# Altium project VentilatorRev1InterimDaughtercard.PrjPcb
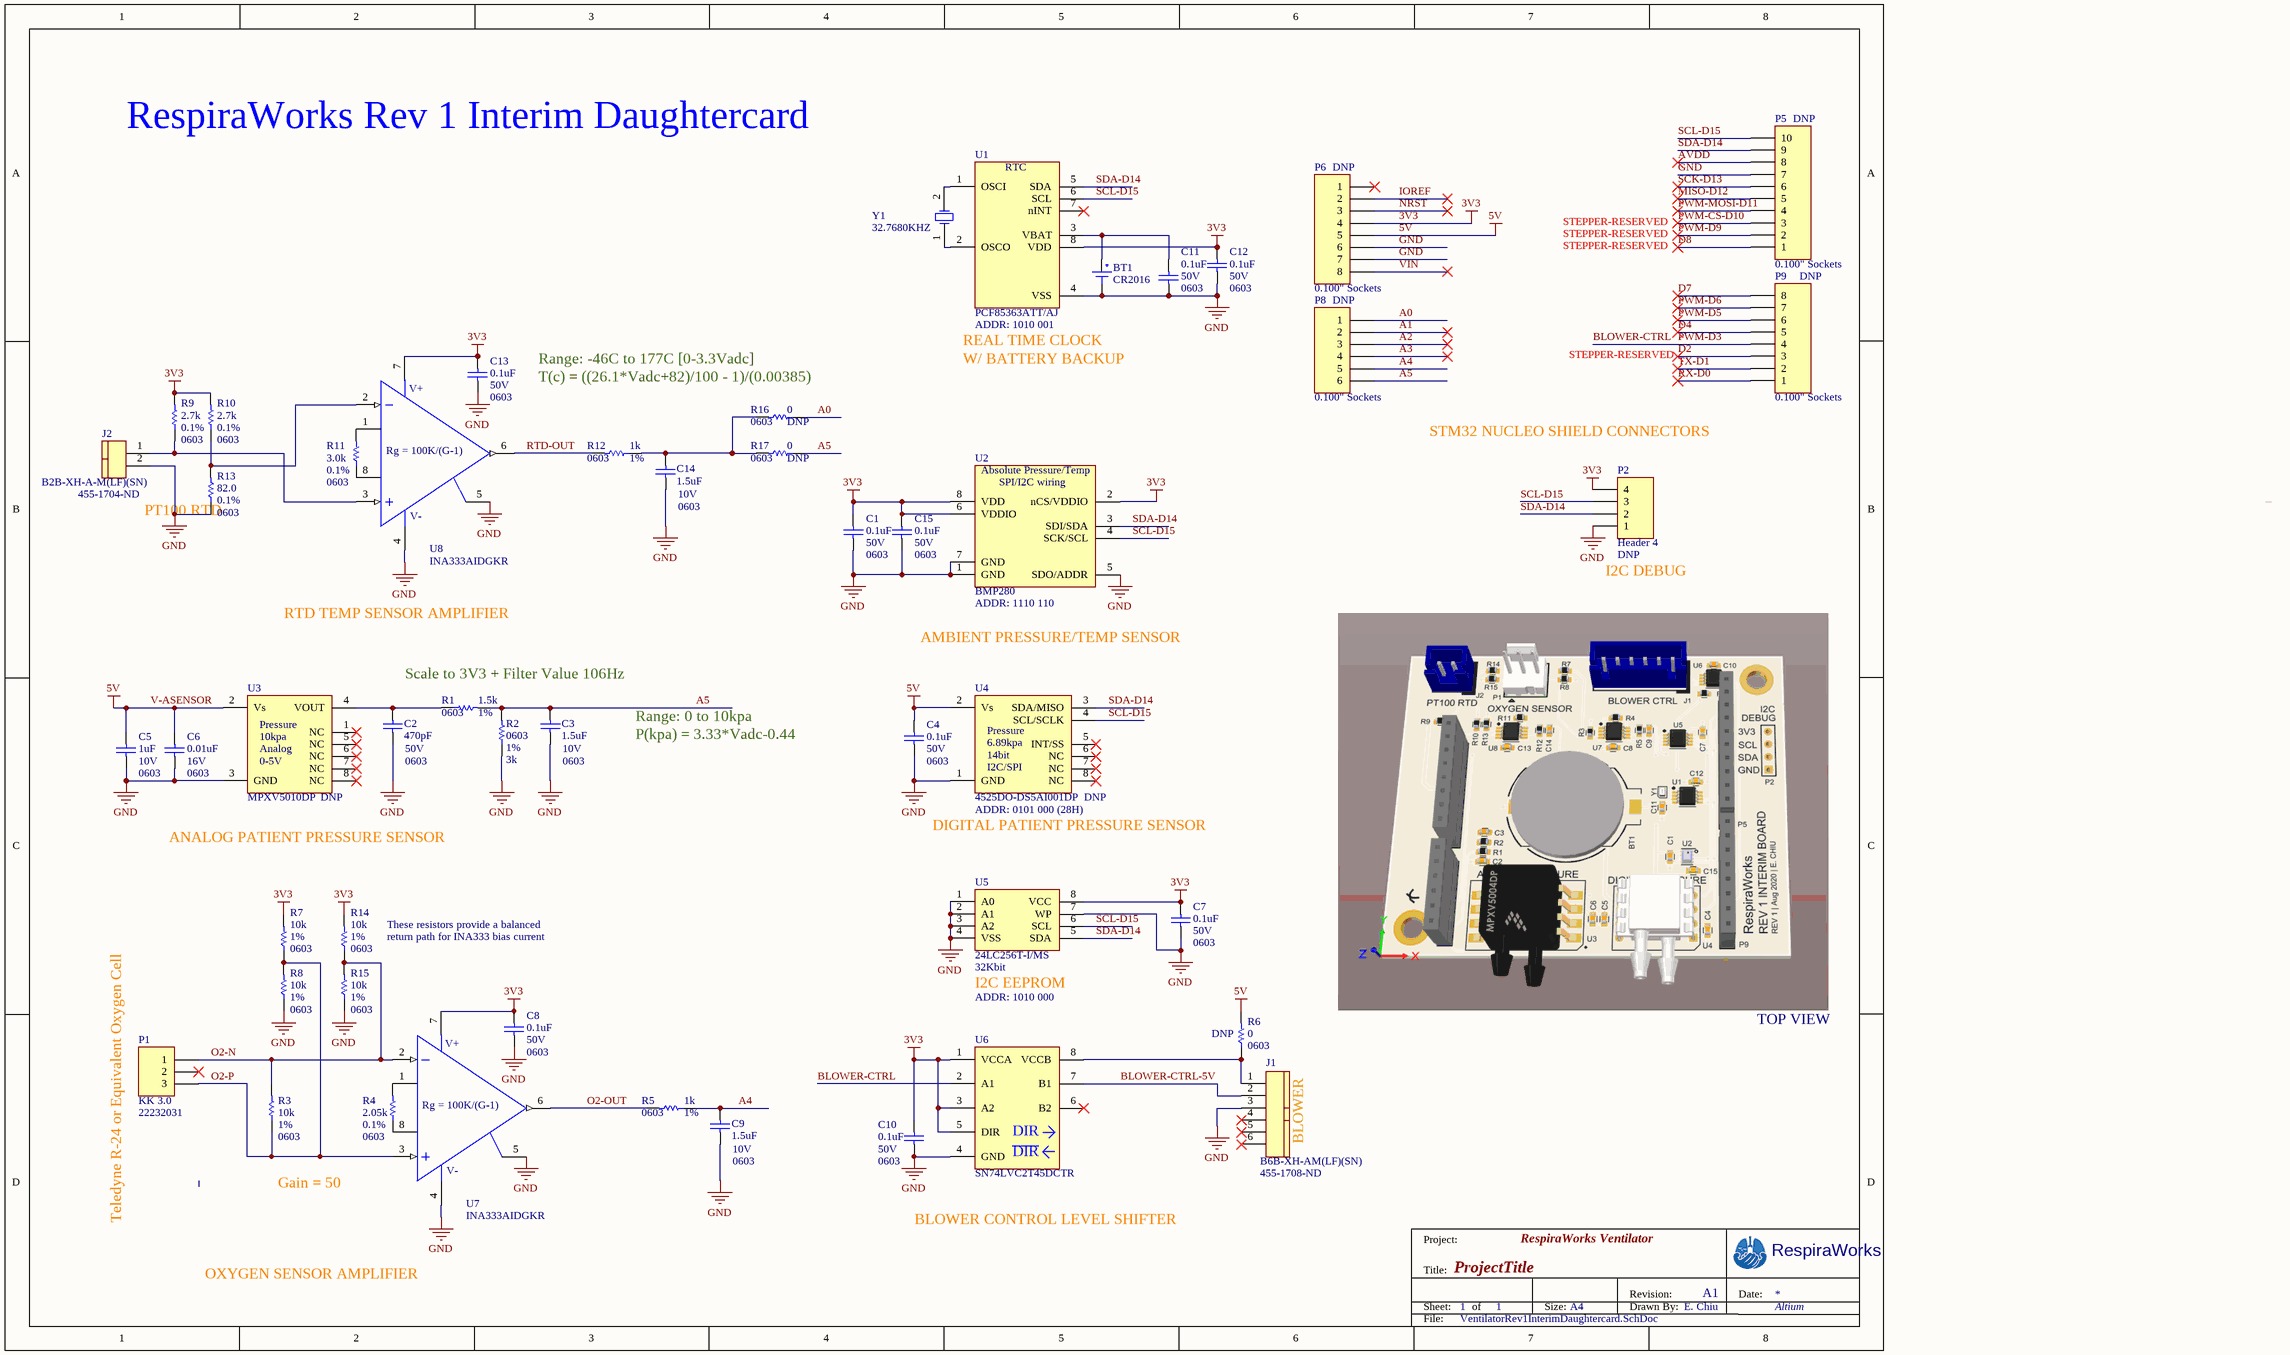
[diagram p0: VentilatorRev1InterimDaughtercard.SchDoc]
1 sheet, 50 parts. Net scope: global (net labels, ports and power ports of the same name join across sheets).
Board file: VentilatorRev1InterimDaughtercard.PcbDoc

## Sheet VentilatorRev1InterimDaughtercard.SchDoc: ProjectTitle
size A3; CompanyName: RespiraWorks; DrawnBy: E. Chiu; Organization: Altium; DocumentNumber: 1; Revision: A1; SheetNumber: 1; SheetTotal: 1; PageSetup: Record=PageOptions|CenterHorizontal=True|CenterVertical=True|PrintScale=0.67|XCorrection=1.00|YCorrection=1.00|PrintKind=0|BorderSize=5000000|LeftOffset=0|BottomOffset=0|Orientation=2|PaperLength=1000|PaperWidth=1000|Scale=100|PaperSource=276|PrintQuality=-3|MediaType=1|DitherType=10|PrintScaleMode=1|PaperKind=11"x17" 279.4x431.8mm|PaperIndex=3; ProjectName: FALCON 3S

### Parts
BT1  CR2016  [BLP20]
C1  value 0.1uF  Voltage: 50V  PCB Package: 0603  [CAP0603]  (hidden comment: CAP 0603)
C2  value 470pF  Voltage: 50V  PCB Package: 0603  [CAP0603]  (hidden comment: CAP 0603)
C3  value 1.5uF  Voltage: 10V  PCB Package: 0603  [CAP0603]  (hidden comment: CAP 0603)
C4  value 0.1uF  Voltage: 50V  PCB Package: 0603  [CAP0603]  (hidden comment: CAP 0603)
C5  value 1uF  Voltage: 10V  PCB Package: 0603  [CAP0603]  (hidden comment: CAP 0603)
C6  value 0.01uF  Voltage: 16V  PCB Package: 0603  [CAP0603]  (hidden comment: CAP 0603)
C7  value 0.1uF  Voltage: 50V  PCB Package: 0603  [CAP0603]  (hidden comment: CAP 0603)
C8  value 0.1uF  Voltage: 50V  PCB Package: 0603  [CAP0603]  (hidden comment: CAP 0603)
C9  value 1.5uF  Voltage: 10V  PCB Package: 0603  [CAP0603]  (hidden comment: CAP 0603)
C10  value 0.1uF  Voltage: 50V  PCB Package: 0603  [CAP0603]  (hidden comment: CAP 0603)
C11  value 0.1uF  Voltage: 50V  PCB Package: 0603  [CAP0603]  (hidden comment: CAP 0603)
C12  value 0.1uF  Voltage: 50V  PCB Package: 0603  [CAP0603]  (hidden comment: CAP 0603)
C13  value 0.1uF  Voltage: 50V  PCB Package: 0603  [CAP0603]  (hidden comment: CAP 0603)
C14  value 1.5uF  Voltage: 10V  PCB Package: 0603  [CAP0603]  (hidden comment: CAP 0603)
C15  value 0.1uF  Voltage: 50V  PCB Package: 0603  [CAP0603]  (hidden comment: CAP 0603)
J1  Supplier Part Number 1: 455-1708-ND  [JST_B6B-XH-AM]  (hidden comment: B6B-XH-AM(LF)(SN))
J2  Manufacturer P/N: B2B-XH-A-M(LF)(SN)  Supplier Part Number 1: 455-1704-ND  [JST_B2B-XH-AM]  (hidden comment: B2B-XH-AM(LF)(SN))
P1  KK 3.0  [22232031]
P2  Header 4  Do Not Populate: DNP  [HDR1X4]
P5  0.100" Sockets  Do Not Populate: DNP  [ESQ-110-14-T-S]
P6  0.100" Sockets  Do Not Populate: DNP  [ESQ-108-14-T-S]
P8  0.100" Sockets  Do Not Populate: DNP  [ESQ-106-14-T-S]
P9  0.100" Sockets  Do Not Populate: DNP  [ESQ-108-14-T-S]
R1  value 1.5k  PCB Package: 0603  Tolerance: 1%  [RES0603]  (hidden comment: RES 0603)
R2  value 3k  PCB Package: 0603  Tolerance: 1%  [RES0603]  (hidden comment: RES 0603)
R3  value 10k  PCB Package: 0603  Tolerance: 1%  [RES0603]  (hidden comment: RES 0603)
R4  value 2.05k  PCB Package: 0603  Tolerance: 0.1%  [RES0603]  (hidden comment: RES 0603)
R5  value 1k  PCB Package: 0603  Tolerance: 1%  [RES0603]  (hidden comment: RES 0603)
R6  value 0  PCB Package: 0603  Do Not Populate: DNP  [RES0603]  (hidden comment: RES 0603)
R7  value 10k  PCB Package: 0603  Tolerance: 1%  [RES0603]  (hidden comment: RES 0603)
R8  value 10k  PCB Package: 0603  Tolerance: 1%  [RES0603]  (hidden comment: RES 0603)
R9  value 2.7k  PCB Package: 0603  Tolerance: 0.1%  [RES0603]  (hidden comment: RES 0603)
R10  value 2.7k  PCB Package: 0603  Tolerance: 0.1%  [RES0603]  (hidden comment: RES 0603)
R11  value 3.0k  PCB Package: 0603  Tolerance: 0.1%  [RES0603]  (hidden comment: RES 0603)
R12  value 1k  PCB Package: 0603  Tolerance: 1%  [RES0603]  (hidden comment: RES 0603)
R13  value 82.0  PCB Package: 0603  Tolerance: 0.1%  [RES0603]  (hidden comment: RES 0603)
R14  value 10k  PCB Package: 0603  Tolerance: 1%  [RES0603]  (hidden comment: RES 0603)
R15  value 10k  PCB Package: 0603  Tolerance: 1%  [RES0603]  (hidden comment: RES 0603)
R16  value 0  PCB Package: 0603  Do Not Populate: DNP  [RES0603]  (hidden comment: RES 0603)
R17  value 0  PCB Package: 0603  Do Not Populate: DNP  [RES0603]  (hidden comment: RES 0603)
U1  PCF85363ATT/AJ  [8-MSOP-3.0MM]
U2  BMP280  [BMP280]
U3  Do Not Populate: DNP  [8-SOP-MPXV]  (hidden comment: MPXV5010DP)
U4  Do Not Populate: DNP  [4525do]  (hidden comment: 4525DO-DS5AI001DP)
U5  value 32Kbit  [8-MSOP]  (hidden comment: 256Kbit)
U6  SN74LVC2T45DCTR  [8-MSOP]
U7  Manufacturer P/N: INA333AIDGKR  [8-VSSOP]  (hidden comment: INA333)
U8  Manufacturer P/N: INA333AIDGKR  [8-VSSOP]  (hidden comment: INA333)
Y1  32.7680KHZ  [2-ABS05]

### Nets
3V3: C1.2 C7.2 C8.2 C10.2 C12.2 C13.2 C15.2 P2.4 P6.4 R7.2 R9.2 R10.2 R14.2 U1.8(VDD) U2.2(nCS/VDDIO) U2.6(VDDIO) U2.8(VDD) U5.8(VCC) U6.1(VCCA) U6.3(A2) U6.5(DIR) U7.7(V+) U8.7(V+)
5V: C4.2 C5.1 C6.1 P6.5 R6.2 U3.2(Vs) U4.2(Vs)  [also labelled V-ASENSOR]
GND: BT1.M C1.1 C2.1 C3.1 C4.1 C5.2 C6.2 C7.1 C8.1 C9.1 C10.1 C11.1 C12.1 C13.1 C14.1 C15.1 J1.3 J2.2 P2.1 P5.7 P6.6 P6.7 R2.1 R8.1 R13.1 R15.1 U1.4(VSS) U2.1(GND) U2.5(SDO/ADDR) U2.7(GND) U3.3(GND) U4.1(GND) U5.1(A0) U5.2(A1) U5.3(A2) U5.4(VSS) U5.7(WP) U6.4(GND) U7.4(V-) U7.5 U8.4(V-) U8.5
A0: P8.1 R16.1
A1: P8.2
A2: P8.3
A3: P8.4
A4: C9.2 P8.5 R5.1
A5: C3.2 P8.6 R1.2 R2.2 R17.1
AVDD: P5.8
BLOWER-CTRL: P9.4 U6.2(A1)  [also labelled PWM-D3]
BLOWER-CTRL-5V: J1.2 U6.7(B1)
D2: P9.3
D4: P9.5
D7: P9.8
D8: P5.1
IOREF: P6.2
MISO-D12: P5.5
NRST: P6.3
O2-N: P1.1 R3.2 R14.1 R15.2 U7.2(IN-)
O2-OUT: R5.2 U7.6(OUT)
O2-P: P1.3 R3.1 R7.1 R8.2 U7.3(IN+)
PWM-CS-D10: P5.3
PWM-D5: P9.6
PWM-D6: P9.7
PWM-D9: P5.2
PWM-MOSI-D11: P5.4
RTD-OUT: R12.2 U8.6(OUT)
RX-D0: P9.1
SCK-D13: P5.6
SCL-D15: P2.3 P5.10 U1.6(SCL) U2.4(SCK/SCL) U4.4(SCL/SCLK) U5.6(SCL)
SDA-D14: P2.2 P5.9 U1.5(SDA) U2.3(SDI/SDA) U4.3(SDA/MISO) U5.5(SDA)
TX-D1: P9.2
VIN: P6.8
NetBT1_P: BT1.P C11.2 U1.3(VBAT)
NetC2_2: C2.2 R1.1 U3.4(VOUT)
NetC14_2: C14.2 R12.1 R16.2 R17.2
NetJ1_1: J1.1 R6.1 U6.8(VCCB)
NetJ2_1: J2.1 R9.1 U8.3(IN+)
NetR4_1: R4.1 U7.8
NetR4_2: R4.2 U7.1
NetR10_1: R10.1 R13.2 U8.2(IN-)
NetR11_1: R11.1 U8.8
NetR11_2: R11.2 U8.1
NetU1_1: U1.1(OSCI) Y1.2(OSC2)
NetU1_2: U1.2(OSCO) Y1.1(OSC1)

Not connected (* = marked no-connect by the designer): J1 4* 5* 6*; P1 2*; P6 1*; U1 7(nINT)*; U3 1(NC)* 5(NC)* 6(NC)* 7(NC)* 8(NC)*; U4 5(INT/SS)* 6(NC)* 7(NC)* 8(NC)*; U6 6(B2)*

### Notes on the sheet
- RespiraWorks Rev 1 Interim Daughtercard
- STEPPER-RESERVED
- (near U1) ADDR: 1010 001
- T(c) = ((26.1*Vadc+82)/100 - 1)/(0.00385)
- Range: -46C to 177C [0-3.3Vadc]
- REAL TIME CLOCK
- W/ BATTERY BACKUP
- STM32 NUCLEO SHIELD CONNECTORS
- (near J2) PT100 RTD
- (near P2) I2C DEBUG
- RTD TEMP SENSOR AMPLIFIER
- AMBIENT PRESSURE/TEMP SENSOR
- (near U2) ADDR: 1110 110
- Scale to 3V3 + Filter Value 106Hz
- P(kpa) = 3.33*Vadc-0.44
- Range: 0 to 10kpa
- (near U4) ADDR: 0101 000 (28H)
- ANALOG PATIENT PRESSURE SENSOR
- (near U4) DIGITAL PATIENT PRESSURE SENSOR
- These resistors provide a balanced
- return path for INA333 bias current
- (near U5) I2C EEPROM
- ADDR: 1010 000
- TOP VIEW
- Gain = 50
- (near J1) BLOWER
- Teledyne R-24 or Equivalent Oxygen Cell
- BLOWER CONTROL LEVEL SHIFTER
- Project:
- RespiraWorks Ventilator
- OXYGEN SENSOR AMPLIFIER
- Title:
- Sheet:
- of
- Size:
- A4
- Drawn By:
- Revision:
- Date:
- File:
- (in symbol 4525DO-DS5AI001DP) Pressure; 6.89kpa; 14bit; I2C/SPI
- (in symbol BMP280) Absolute Pressure/Temp; SPI/I2C wiring
- (in symbol INA333) Rg = 100K/(G-1)
- (in symbol MPXV5010DP) Pressure; 10kpa; Analog; 0-5V
- (in symbol PCF85363ATT/AJ) RTC

### Library data of the parts
BT1 = BLP2016SM-GTR: CR2016 Coil Cell Battery Holder; Manufacturer: MPD; Voltage: 3V; Manufacturer P/N: BLP2016SM-GTR; PCB Package: BLP20; Do Not Populate: *
C1 C4 C7 C8 C10-C13 C15 = CAP 0603: Manufacturer P/N: C0603C104M5RACTU; Manufacturer: Kemet; Type: X7R; Do Not Populate: *
C2 = CAP 0603: Manufacturer P/N: C0603C471K5RACTU; Manufacturer: Kemet; Type: X7R; Do Not Populate: *
C3 C9 C14 = CAP 0603: Manufacturer P/N: C1608X7R1A155K080AC; Manufacturer: TDK; Type: X7R; Do Not Populate: *
C5 = CAP 0603: Manufacturer P/N: CC0603KRX7R6BB105; Manufacturer: Yageo; Type: X7R; Do Not Populate: *
C6 = CAP 0603: Manufacturer P/N: CL10B103KO8NNNC; Manufacturer: Samsung; Type: X7R; Do Not Populate: *
J1 = B6B-XH-AM(LF)(SN): CONN HEADER VERT 6POS 2.5MM; Manufacturer: JST Sales America Inc.; Connector Type: Header, Shrouded; Number of Positions: 6; Number of Positions Loaded: All; Pitch: 0.079" (2.00mm); Supplier 1: Digi-Key; Manufacturer P/N: B6B-XH-AM(LF)(SN); RoHS: RoHS Compliant; Category: Connectors, Interconnects; Stock 1: 30111; Pricing 1: 1=0.33, 10=0.313, 100=0.2194, 500=0.18808, 1000=0.15674, 5000=0.13435, 10000=0.12539 (USD); Packaging: Bulk; Part Status: Active; Contact Type: Male Pin; Number of Rows: 1; Row Spacing: -; Contact Mating Length: 0.130" (3.30mm); Mounting Type: Through Hole; Termination: Press-Fit, Solder; Fastening Type: Detent Lock; Features: -; Contact Finish: Tin; Contact Finish Thickness: -; Color: Natural; ComponentLink1URL: http://www.jst-mfg.com/product/pdf/eng/ePH.pdf; ComponentLink1Description: http://www.jst-mfg.com/product/pdf/eng/ePH.pdf
J2 = B2B-XH-AM(LF)(SN): CONN HEADER VERT 2POS 2.5MM; Manufacturer: JST Sales America Inc.; Connector Type: Header, Shrouded; Number of Positions: 2; Number of Positions Loaded: All; Pitch: 0.079" (2.00mm); Supplier 1: Digi-Key; RoHS: RoHS Compliant; Category: Connectors, Interconnects; Stock 1: 207967; Pricing 1: 1=0.17, 10=0.162, 100=0.1002, 500=0.08288, 1000=0.07252, 5000=0.06216, 10000=0.06044 (USD); Packaging: Bulk; Part Status: Active; Contact Type: Male Pin; Number of Rows: 1; Row Spacing: -; Contact Mating Length: 0.130" (3.30mm); Mounting Type: Through Hole; Termination: Press-Fit, Solder; Fastening Type: Detent Lock; Features: -; Contact Finish: Tin; Contact Finish Thickness: -; Color: Natural; ComponentLink1URL: http://www.jst-mfg.com/product/pdf/eng/ePH.pdf; ComponentLink1Description: http://www.jst-mfg.com/product/pdf/eng/ePH.pdf
P1 = 22232031: Conn, KK 0.100" Male Header; Manufacturer: Molex; Manufacturer P/N: 22232031
P2 = Header 4: Header, 4-Pin; LatestRevisionDate: 17-Jul-2002; LatestRevisionNote: Re-released for DXP Platform.; Publisher: Altium Limited
P5 = ESQ-110-14-T-S: Tall Female Header 0.100" Pitch 8x1 Sockets; Manufacturer: Samtec; PCB Package: ESQ-110-14-T-S; Tolerance: *; Value: *
P6 P9 = ESQ-108-14-T-S: Tall Female Header 0.100" Pitch 8x1 Sockets; Manufacturer: Samtec; PCB Package: ESQ-108-14-T-S; Tolerance: *; Value: *
P8 = ESQ-106-14-T-S: Tall Female Header 0.100" Pitch 6x1 Sockets; Manufacturer: Samtec; PCB Package: ESQ-106-14-T-S; Tolerance: *; Value: *
R1 = RES 0603: Manufacturer P/N: RC0603FR-071K5L; Manufacturer: Yageo; Do Not Populate: *
R2 = RES 0603: Manufacturer P/N: RC0603FR-073KL; Manufacturer: Yageo; Do Not Populate: *
R3 R7 R8 R14 R15 = RES 0603: Manufacturer P/N: RC0603FR-0710KL; Manufacturer: Yageo; Do Not Populate: *
R4 = RES 0603: Manufacturer P/N: RT0603BRD072K05L; Manufacturer: Yageo; Do Not Populate: *
R5 R12 = RES 0603: Manufacturer P/N: RC0603FR-071KL; Manufacturer: Yageo; Do Not Populate: *
R6 R16 R17 = RES 0603: Manufacturer P/N: RC0603JR-070RL; Manufacturer: Yageo; Tolerance: 5%
R9 R10 = RES 0603: Manufacturer P/N: ERA-3AEB272V; Manufacturer: Panasonic; Do Not Populate: *
R11 = RES 0603: Manufacturer P/N: RT0603BRE073KL; Manufacturer: Yageo; Do Not Populate: *
R13 = RES 0603: Manufacturer P/N: ERA-3AEB820V; Manufacturer: Panasonic; Do Not Populate: *
U1 = PCF85363ATT/AJ: Real Time Clock (RTC) IC Clock/Calendar 64B I²C, 2-Wire Serial 8-TSSOP, 8-MSOP (0.118", 3.00mm Width); Manufacturer: NXP; Do Not Populate: *; PCB Package: 8-MSOP-3.0MM; Manufacturer P/N: PCF85363ATT/AJ
U2 = BMP280: Pressure Sensor 4.35PSI ~ 15.95PSI (30kPa ~ 110kPa) Absolute  16b 8-SMD; Manufacturer: Bosch Sensortec; PCB Package: BMP280; Do Not Populate: *; Manufacturer P/N: BMP280
U3 = MPXV5010DP: Pressure Sensor 1.45PSI (10kPa) Differential Male - 0.13" (3.3mm) Tube, Dual 0.2 V ~ 4.7 V 8-BSOP (0.475", 12.06mm Width) Dual Ports, Same Side; Manufacturer: NXP; PCB Package: 8-SOP-MPXV; Manufacturer P/N: MPXV5010DP
U4 = 4525DO-DS5AI001DP: Pressure Sensor 1PSI (6.89kPa) Differential Male - 0.14" (3.56mm) Tube, Dual 14 b 8-DIP Module; Manufacturer: TE Connectivity; PCB Package: 4525DO; Manufacturer P/N: 4525DO-DS5AI001DP
U5 = 24LC256T-I/MS: IC EEPROM 256KBIT I2C 400KHZ 8MSOP; Manufacturer: Microchip; Tolerance: 25ppm; PCB Package: 8-MSOP; Do Not Populate: *; Manufacturer P/N: 24LC256T-I/MS
U6 = SN74LVC2T45DCTR: Bidirectional Level Shifter 2-ch; Manufacturer: Texas Instruments; PCB Package: 16-TSSOP; Do Not Populate: *; Manufacturer P/N: SN74LVC2T45DCTR
U7 U8 = INA333: Instrumentation Amp, GBW=1MHz; Manufacturer: Texas Instruments; Do Not Populate: *; PCB Package: 8-VSSOP
Y1 = ABS05-32.768KHZ-T: CRYSTAL 32.7680KHZ 12.5PF SMD 1x1.6mm; Manufacturer: Abracon; Tolerance: 20ppm; Manufacturer P/N: ABS05-32.768KHZ-T; PCB Package: ABS05-32.768KHZ-T; Do Not Populate: *; Value: 32.7680KHZ